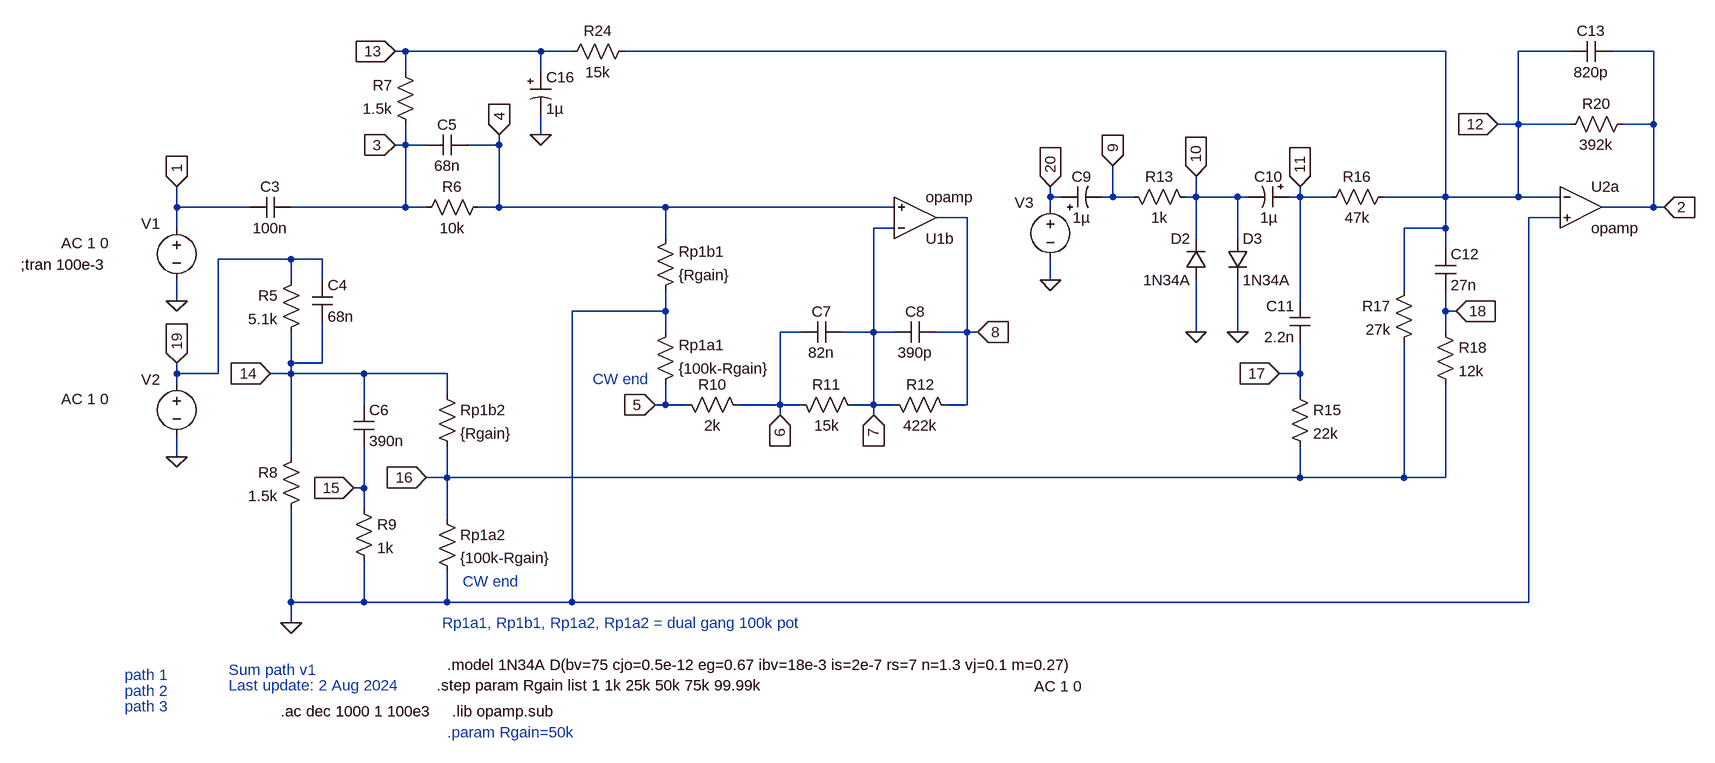
[diagram p0: schematic Klon-Centaur_sum_path_v1.asc]
Klon-Centaur_sum_path_v1.asc, the LTspice schematic file:
Version 4
SHEET 1 4496 5064
WIRE -32 2320 -48 2320
WIRE 176 2320 -32 2320
WIRE 224 2320 176 2320
WIRE 1568 2320 304 2320
WIRE 1760 2320 1680 2320
WIRE 1888 2320 1824 2320
WIRE -32 2352 -32 2320
WIRE 176 2352 176 2320
WIRE 1680 2432 1680 2320
WIRE 1680 2432 1648 2432
WIRE 1760 2432 1680 2432
WIRE 1888 2432 1888 2320
WIRE 1888 2432 1840 2432
WIRE 176 2448 176 2416
WIRE -32 2464 -32 2432
WIRE -32 2464 -48 2464
WIRE 0 2464 -32 2464
WIRE 112 2464 112 2448
WIRE 112 2464 64 2464
WIRE 960 2544 960 2528
WIRE 976 2544 960 2544
WIRE 1056 2544 1056 2496
WIRE 1056 2544 1040 2544
WIRE 1088 2544 1056 2544
WIRE 1184 2544 1184 2512
WIRE 1184 2544 1168 2544
WIRE 1248 2544 1184 2544
WIRE 1264 2544 1248 2544
WIRE 1344 2544 1344 2528
WIRE 1344 2544 1328 2544
WIRE 1392 2544 1344 2544
WIRE 1568 2544 1568 2320
WIRE 1568 2544 1472 2544
WIRE 1680 2544 1680 2432
WIRE 1680 2544 1568 2544
WIRE 1744 2544 1680 2544
WIRE -384 2560 -384 2528
WIRE -272 2560 -384 2560
WIRE -32 2560 -32 2464
WIRE -32 2560 -208 2560
WIRE 0 2560 -32 2560
WIRE 112 2560 112 2464
WIRE 112 2560 80 2560
WIRE 368 2560 112 2560
WIRE 720 2560 368 2560
WIRE 960 2560 960 2544
WIRE 1888 2560 1888 2432
WIRE 1888 2560 1808 2560
WIRE 1904 2560 1888 2560
WIRE 832 2576 784 2576
WIRE 1744 2576 1696 2576
WIRE -384 2592 -384 2560
WIRE 720 2592 688 2592
WIRE 1568 2592 1568 2544
WIRE 1568 2592 1504 2592
WIRE 368 2608 368 2560
WIRE 1184 2608 1184 2544
WIRE 1248 2608 1248 2544
WIRE 1568 2624 1568 2592
WIRE -208 2640 -320 2640
WIRE -160 2640 -208 2640
WIRE -208 2672 -208 2640
WIRE -160 2672 -160 2640
WIRE 960 2672 960 2640
WIRE 1504 2688 1504 2592
WIRE -384 2704 -384 2672
WIRE 1344 2704 1344 2544
WIRE 368 2720 368 2688
WIRE 368 2720 224 2720
WIRE 1568 2720 1568 2688
WIRE 1584 2720 1568 2720
WIRE 368 2752 368 2720
WIRE 576 2752 544 2752
WIRE 688 2752 688 2592
WIRE 688 2752 640 2752
WIRE 720 2752 688 2752
WIRE 832 2752 832 2576
WIRE 832 2752 784 2752
WIRE 848 2752 832 2752
WIRE 1184 2752 1184 2672
WIRE 1248 2752 1248 2672
WIRE 1568 2752 1568 2720
WIRE -208 2800 -208 2752
WIRE -160 2800 -160 2736
WIRE -160 2800 -208 2800
WIRE -384 2816 -384 2800
WIRE -320 2816 -320 2640
WIRE -320 2816 -384 2816
WIRE -208 2816 -208 2800
WIRE -208 2816 -240 2816
WIRE -96 2816 -208 2816
WIRE 32 2816 -96 2816
WIRE 1344 2816 1344 2768
WIRE 1344 2816 1312 2816
WIRE -384 2832 -384 2816
WIRE 32 2848 32 2816
WIRE 1344 2848 1344 2816
WIRE -96 2864 -96 2816
WIRE 368 2864 368 2832
WIRE 368 2864 352 2864
WIRE 400 2864 368 2864
WIRE 544 2864 544 2752
WIRE 544 2864 480 2864
WIRE 576 2864 544 2864
WIRE 688 2864 688 2752
WIRE 688 2864 656 2864
WIRE 720 2864 688 2864
WIRE 832 2864 832 2752
WIRE 832 2864 800 2864
WIRE 544 2880 544 2864
WIRE 688 2880 688 2864
WIRE -384 2944 -384 2912
WIRE -208 2944 -208 2816
WIRE 32 2976 32 2928
WIRE 32 2976 0 2976
WIRE 1344 2976 1344 2928
WIRE 1344 2976 32 2976
WIRE 1504 2976 1504 2768
WIRE 1504 2976 1344 2976
WIRE 1568 2976 1568 2832
WIRE 1568 2976 1504 2976
WIRE -96 2992 -96 2928
WIRE -96 2992 -112 2992
WIRE -96 3024 -96 2992
WIRE 32 3040 32 2976
WIRE -208 3168 -208 3024
WIRE -96 3168 -96 3104
WIRE -96 3168 -208 3168
WIRE 32 3168 32 3120
WIRE 32 3168 -96 3168
WIRE 224 3168 224 2720
WIRE 224 3168 32 3168
WIRE 1696 3168 1696 2576
WIRE 1696 3168 224 3168
WIRE -208 3200 -208 3168
FLAG -384 2528 1
IOPIN -384 2528 In
FLAG 1248 2752 0
FLAG 1184 2752 0
FLAG 176 2448 0
FLAG 1904 2560 2
IOPIN 1904 2560 In
FLAG -208 3200 0
FLAG -384 2704 0
FLAG -48 2464 3
IOPIN -48 2464 In
FLAG -48 2320 13
IOPIN -48 2320 In
FLAG 112 2448 4
IOPIN 112 2448 In
FLAG 352 2864 5
IOPIN 352 2864 In
FLAG 544 2880 6
IOPIN 544 2880 In
FLAG 688 2880 7
IOPIN 688 2880 In
FLAG 848 2752 8
IOPIN 848 2752 In
FLAG 1056 2496 9
IOPIN 1056 2496 In
FLAG 1184 2512 10
IOPIN 1184 2512 In
FLAG 1344 2528 11
IOPIN 1344 2528 In
FLAG 1312 2816 17
IOPIN 1312 2816 In
FLAG 1584 2720 18
IOPIN 1584 2720 In
FLAG 0 2976 16
IOPIN 0 2976 In
FLAG -112 2992 15
IOPIN -112 2992 In
FLAG -240 2816 14
IOPIN -240 2816 In
FLAG 1648 2432 12
IOPIN 1648 2432 In
FLAG -384 2800 19
IOPIN -384 2800 In
FLAG -384 2944 0
FLAG 960 2528 20
IOPIN 960 2528 In
FLAG 960 2672 0
SYMBOL voltage -384 2576 R0
WINDOW 0 -55 9 Left 2
WINDOW 123 -178 39 Left 2
WINDOW 39 0 0 Left 0
WINDOW 3 -493 7 Left 2
SYMATTR InstName V1
SYMATTR Value2 AC 1 0
SYMATTR Value ""
SYMBOL res -192 2656 M0
SYMATTR InstName R5
SYMATTR Value 5.1k
SYMBOL res -192 2928 M0
SYMATTR InstName R8
SYMATTR Value 1.5k
SYMBOL cap -208 2544 R90
WINDOW 0 0 32 VBottom 2
WINDOW 3 32 32 VTop 2
SYMATTR InstName C3
SYMATTR Value 100n
SYMBOL cap -176 2672 R0
SYMATTR InstName C4
SYMATTR Value 68n
SYMBOL cap -112 2864 R0
SYMATTR InstName C6
SYMATTR Value 390n
SYMBOL res -112 3008 R0
SYMATTR InstName R9
SYMATTR Value 1k
SYMBOL res 96 2544 R90
WINDOW 0 0 56 VBottom 2
WINDOW 3 32 56 VTop 2
SYMATTR InstName R6
SYMATTR Value 10k
SYMBOL cap 64 2448 R90
WINDOW 0 0 32 VBottom 2
WINDOW 3 32 32 VTop 2
SYMATTR InstName C5
SYMATTR Value 68n
SYMBOL res 16 2832 R0
SYMATTR InstName Rp1b2
SYMATTR Value {Rgain}
SYMBOL res 16 3024 R0
SYMATTR InstName Rp1a2
SYMATTR Value {100k-Rgain}
SYMBOL res 352 2704 M180
WINDOW 0 36 76 Left 2
WINDOW 3 36 40 Left 2
SYMATTR InstName Rp1b1
SYMATTR Value {Rgain}
SYMBOL res 352 2848 M180
WINDOW 3 36 40 Left 2
WINDOW 0 36 76 Left 2
SYMATTR Value {100k-Rgain}
SYMATTR InstName Rp1a1
SYMBOL res 496 2880 M270
WINDOW 0 32 56 VTop 2
WINDOW 3 0 56 VBottom 2
SYMATTR InstName R10
SYMATTR Value 2k
SYMBOL res 672 2880 M270
WINDOW 0 32 56 VTop 2
WINDOW 3 0 56 VBottom 2
SYMATTR InstName R11
SYMATTR Value 15k
SYMBOL cap 640 2768 M270
WINDOW 0 32 32 VTop 2
WINDOW 3 0 32 VBottom 2
SYMATTR InstName C7
SYMATTR Value 82n
SYMBOL cap 784 2768 M270
WINDOW 0 32 32 VTop 2
WINDOW 3 0 32 VBottom 2
SYMATTR InstName C8
SYMATTR Value 390p
SYMBOL res 816 2880 M270
WINDOW 0 32 56 VTop 2
WINDOW 3 0 56 VBottom 2
SYMATTR InstName R12
SYMATTR Value 422k
SYMBOL res 1184 2560 M270
WINDOW 0 32 56 VTop 2
WINDOW 3 0 56 VBottom 2
SYMATTR InstName R13
SYMATTR Value 1k
SYMBOL cap 1360 2704 M0
SYMATTR InstName C11
SYMATTR Value 2.2n
SYMBOL res 1328 2832 R0
SYMATTR InstName R15
SYMATTR Value 22k
SYMBOL res 1520 2672 M0
SYMATTR InstName R17
SYMATTR Value 27k
SYMBOL res 1552 2736 R0
SYMATTR InstName R18
SYMATTR Value 12k
SYMBOL cap 1552 2624 R0
SYMATTR InstName C12
SYMATTR Value 27n
SYMBOL res 1488 2528 R90
WINDOW 0 0 56 VBottom 2
WINDOW 3 32 56 VTop 2
SYMATTR InstName R16
SYMATTR Value 47k
SYMBOL res -16 2448 R180
WINDOW 0 36 76 Left 2
WINDOW 3 36 40 Left 2
SYMATTR InstName R7
SYMATTR Value 1.5k
SYMBOL res 320 2304 R90
WINDOW 0 0 56 VBottom 2
WINDOW 3 32 56 VTop 2
SYMATTR InstName R24
SYMATTR Value 15k
SYMBOL res 1856 2416 R90
WINDOW 0 0 56 VBottom 2
WINDOW 3 32 56 VTop 2
SYMATTR InstName R20
SYMATTR Value 392k
SYMBOL cap 1824 2304 R90
WINDOW 0 0 32 VBottom 2
WINDOW 3 32 32 VTop 2
SYMATTR InstName C13
SYMATTR Value 820p
SYMBOL OpAmps\\opamp 752 2640 M180
SYMATTR InstName U1b
SYMBOL OpAmps\\opamp 1776 2496 R0
SYMATTR InstName U2a
SYMBOL diode 1200 2672 R180
WINDOW 0 24 64 Left 2
WINDOW 3 24 0 Left 2
SYMATTR InstName D2
SYMATTR Value 1N34A
SYMBOL diode 1232 2608 R0
SYMATTR InstName D3
SYMATTR Value 1N34A
SYMBOL polcap 160 2352 R0
SYMATTR InstName C16
SYMATTR Value 1µ
SYMBOL polcap 976 2560 R270
WINDOW 0 32 32 VTop 2
WINDOW 3 0 32 VBottom 2
SYMATTR InstName C9
SYMATTR Value 1µ
SYMBOL polcap 1328 2528 R90
WINDOW 0 0 32 VBottom 2
WINDOW 3 32 32 VTop 2
SYMATTR InstName C10
SYMATTR Value 1µ
SYMBOL voltage -384 2816 R0
WINDOW 0 -55 9 Left 2
WINDOW 123 -178 39 Left 2
WINDOW 39 0 0 Left 0
WINDOW 3 -493 7 Left 2
SYMATTR InstName V2
SYMATTR Value2 AC 1 0
SYMATTR Value ""
SYMBOL voltage 960 2544 R0
WINDOW 0 -55 9 Left 2
WINDOW 123 -25 753 Left 2
WINDOW 39 0 0 Left 0
WINDOW 3 -493 7 Left 2
SYMATTR InstName V3
SYMATTR Value2 AC 1 0
SYMATTR Value ""
TEXT 40 3336 Left 2 !.lib opamp.sub
TEXT -224 3336 Left 2 !.ac dec 1000 1 100e3
TEXT 256 2824 Left 2 ;CW end
TEXT 56 3136 Left 2 ;CW end
TEXT 16 3296 Left 2 !.step param Rgain list 1 1k 25k 50k 75k 99.99k
TEXT 24 3200 Left 2 ;Rp1a1, Rp1b1, Rp1a2, Rp1a2 = dual gang 100k pot
TEXT 32 3264 Left 2 !.model 1N34A D(bv=75 cjo=0.5e-12 eg=0.67 ibv=18e-3 is=2e-7 rs=7 n=1.3 vj=0.1 m=0.27)
TEXT -624 2648 Left 2 !;tran 100e-3
TEXT 32 3368 Left 2 ;.param Rgain=50k
TEXT -304 3272 Left 2 ;Sum path v1
TEXT -464 3280 Left 2 ;path 1
TEXT -464 3304 Left 2 ;path 2
TEXT -464 3328 Left 2 ;path 3
TEXT -304 3296 Left 2 ;Last update: 2 Aug 2024

The netlist it stands for:
* Klon-Centaur_sum_path_v1.asc
V1 1 0 AC 1 0
R5 19 14 5.1k
R8 14 0 1.5k
C3 3 1 100n
C4 19 14 68n
C6 14 15 390n
R9 15 0 1k
R6 4 3 10k
C5 4 3 68n
Rp1b2 14 16 {Rgain}
Rp1a2 16 0 {100k-Rgain}
Rp1b1 0 4 {Rgain}
Rp1a1 5 0 {100k-Rgain}
R10 6 5 2k
R11 7 6 15k
C7 7 6 82n
C8 8 7 390p
R12 8 7 422k
R13 10 9 1k
C11 11 17 2.2n
R15 17 16 22k
R17 12 16 27k
R18 18 16 12k
C12 12 18 27n
R16 12 11 47k
R7 3 13 1.5k
R24 12 13 15k
R20 2 12 392k
C13 2 12 820p
XU1b 7 4 8 opamp Aol=100K GBW=10Meg  ; pins invin noninvin out
XU2a 12 0 2 opamp Aol=100K GBW=10Meg  ; pins invin noninvin out
D2 0 10 1N34A
D3 10 0 1N34A
C16 13 0 1µ
C9 20 9 1µ
C10 11 10 1µ
V2 19 0 AC 1 0
V3 20 0 AC 1 0
.model D D
.lib standard.dio
.lib opamp.sub
.ac dec 1000 1 100e3
* CW end
* CW end
.step param Rgain list 1 1k 25k 50k 75k 99.99k
* Rp1a1, Rp1b1, Rp1a2, Rp1a2 = dual gang 100k pot
.model 1N34A D(bv=75 cjo=0.5e-12 eg=0.67 ibv=18e-3 is=2e-7 rs=7 n=1.3 vj=0.1 m=0.27)
;tran 100e-3
* .param Rgain=50k
* Sum path v1
* path 1
* path 2
* path 3
* Last update: 2 Aug 2024
.backanno
.end